# Altium schematic sheet 05-SD CARD.SchDoc
size A4
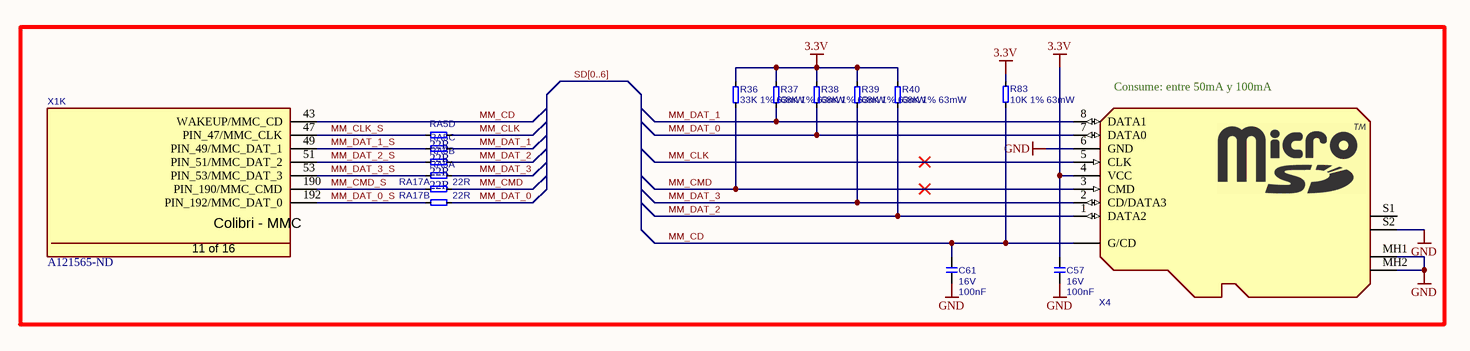
[diagram p0: 05-SD CARD.SchDoc]

## Parts
C57  value 100nF  Rating: 16V  [CAPC1005X60N]  (hidden comment: 100nF 16V 10% X7R)
C61  value 100nF  Rating: 16V  [CAPC1005X60N]  (hidden comment: 100nF 16V 10% X7R)
R36  33K 1% 63mW  [RESC1005X40N]
R37  68K 1% 63mW  [RESC1005X40N]
R38  68K 1% 63mW  [RESC1005X40N]
R39  68K 1% 63mW  [RESC1005X40N]
R40  68K 1% 63mW  [RESC1005X40N]
R83  10K 1% 63mW  [RESC1005X40N]
RA5  22R  [T_Resistor_Array_X4]  (parts A,B,C,D of 4)
RA17  22R  [T_Resistor_Array_X4]  (parts A,B of 4)
X1  Supplier Part Number 1: A121565-ND  [T_Tyco_1473005-1]  (hidden comment: 1473005-1)  (part K of 16)
X4  MEM2051-00-195-00-A  [101-00660-68-6+MEM2051-00-195-00-A_REVC]  (value not drawn)

## Blocks framed on the sheet
Consume: entre 50mA y 100mA: C57 C61 R36-R40 R83 RA5 RA17 X1 X4

## Nets
3.3V: C57.2 R36.2 R37.2 R38.2 R39.2 R40.2 R83.1 X4.4(VCC)
GND: C57.1 C61.1 X4.6(GND) X4.MH1(S) X4.MH2(S) X4.S2
MM_CD: C61.2 R83.2 X1.43(WAKEUP/MMC_CD) X4.G1(G/CD)
MM_CLK: RA5.4 X4.5(CLK)
MM_CLK_S: RA5.8 X1.47(PIN_47/MMC_CLK)
MM_CMD: R36.1 RA17.5 X4.3(CMD)
MM_CMD_S: RA17.1 X1.190(PIN_190/MMC_CMD)
MM_DAT_0: R38.1 RA17.6 X4.7(DATA0)
MM_DAT_0_S: RA17.2 X1.192(PIN_192/MMC_DAT_0)
MM_DAT_1: R37.1 RA5.3 X4.8(DATA1)
MM_DAT_1_S: RA5.7 X1.49(PIN_49/MMC_DAT_1)
MM_DAT_2: R40.1 RA5.2 X4.1(DATA2)
MM_DAT_2_S: RA5.6 X1.51(PIN_51/MMC_DAT_2)
MM_DAT_3: R39.1 RA5.1 X4.2(CD/DATA3)
MM_DAT_3_S: RA5.5 X1.53(PIN_53/MMC_DAT_3)

Not connected (* = marked no-connect by the designer): X4 S1

## Buses and harness runs
bus SD[0..6]

## Notes on the sheet
- (in symbol CON-Tyco-1473005-1-200-0.6mm, part K) Colibri - MMC; 11 of 16

## Library data of the parts
C57 C61 = C-100nF-16V-10%-0603: Capacitor Ceramic X7R 100nF 16V 10% 0603; FP_DESC: C0402; Tolerance: 10%; Type: X7R; Supplier 1: Digi-Key; Supplier Part Number 1: 1276-1001-1-ND; Footprint Checked: -; MFG: *; MFG_PN: *
R36 = R-33K-1%-0402: Resistor 33Kohm 63mW 1% 0402; Value: 330; MFG: <GENERIC>; Power: 63mW; Tolerance: 1%; Footprint: R0402; Supplier 1: Digi-Key; Supplier Part Number 1: 541-33.0KLCT-ND; Footprint Checked: -; MFG_PN: <GENERIC>; Symbol Checked: -
R37-R40 = R-68K-1%-0402_1: Resistor 68Kohm 63mW 1% 0402; MFG: <GENERIC>; Symbol Checked: T; Power: 63mW; Tolerance: 1%; Footprint: R0402; Value: 68K; Supplier 1: Digi-Key; Supplier Part Number 1: 541-68.0KLCT-ND; Footprint Checked: -; MFG_PN: <GENERIC>
R83 = R-10K-1%-0402: Resistor 10Kohm 63mW 1% 0402; MFG: <GENERIC>; Power: 63mW; Tolerance: 1%; Value: 10k; Footprint: R0402; Supplier 1: Digi-Key; Supplier Part Number 1: 541-10.0KLDKR-ND; Footprint Checked: -; MFG_PN: <GENERIC>; Symbol Checked: -
RA5 RA17 = RA-22R-5%-1206-div: Resistor Array 22 R 63mW 5% 1206; MFG: Generic; Tolerance: 5%; Power Dissipation: 63mW; Supplier 1: Digi-Key; Value: 22R; Supplier Part Number 1: TC164J-22CT-ND; Footprint Checked: -; Symbol Checked: -
X1 = CON-Tyco-1473005-1-200-0.6mm: SODIMM Connector; Manufacturer Name: Tyco; No. of ways: 200; Supplier 1: Digi-Key; Manufacturer Part No.: 1473005-1
X4 = CON-GCT-SD-MEM2051-00-195-00-A: 9 (8 + 1) Position Card Connector microSD™ Surface Mount, Right Angle Gold; No. of ways: 9; MFG: GCT; MFG_PN: MEM2051-00-195-00-A; Footprint Checked: -; Symbol Checked: -; Supplier 1: DigiKey; Supplier Part Number 1: 2073-MEM2051-00-195-00-ACT-ND